# Altium schematic sheet REGENIX_ADC.SchDoc
size Tabloid; SheetNumber: 11; SheetTotal: 17; Sheet_Name: Insert name in Document Parameters; Size: 11x17
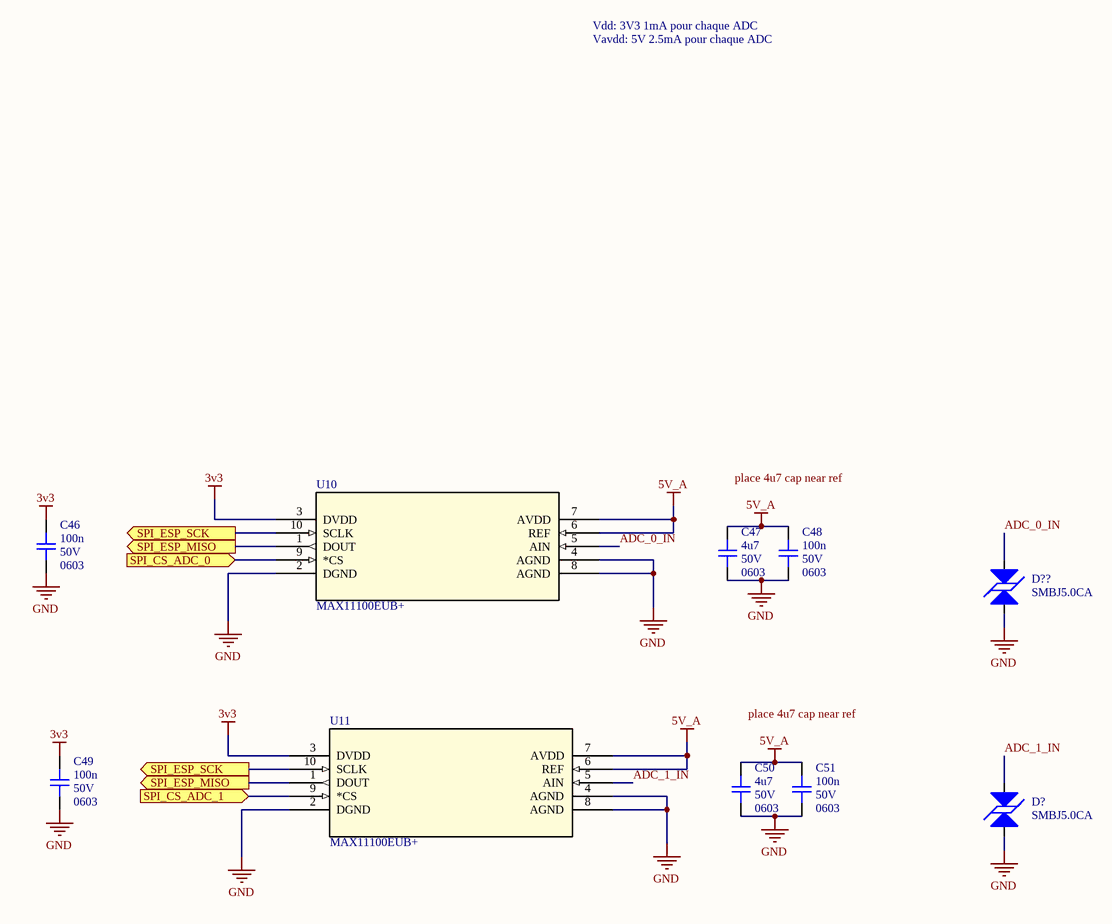
[diagram p0: REGENIX_ADC.SchDoc]

## Parts
C46  value 100n  Voltage: 50V  Package: 0603  [CAP_0603]  (hidden comment: CAP - 0603)
C47  value 4u7  Voltage: 50V  Package: 0603  [CAP_0603]  (hidden comment: CAP - 0603)
C48  value 100n  Voltage: 50V  Package: 0603  [CAP_0603]  (hidden comment: CAP - 0603)
C49  value 100n  Voltage: 50V  Package: 0603  [CAP_0603]  (hidden comment: CAP - 0603)
C50  value 4u7  Voltage: 50V  Package: 0603  [CAP_0603]  (hidden comment: CAP - 0603)
C51  value 100n  Voltage: 50V  Package: 0603  [CAP_0603]  (hidden comment: CAP - 0603)
D?  SMBJ5.0CA  [TVS_PWR_SMBJ5.0CA]
D??  SMBJ5.0CA  [TVS_PWR_SMBJ5.0CA]
U10  MAX11100EUB+  [21-0061L_MXM]
U11  MAX11100EUB+  [21-0061L_MXM]

## Ports
SPI_CS_ADC_0 (in), SPI_CS_ADC_1 (in), SPI_ESP_MISO (out), SPI_ESP_SCK (out)

## Nets
3v3: C46.2 C49.2 U10.3(DVDD) U11.3(DVDD)
5V_A: C47.2 C48.2 C50.2 C51.2 U10.6(REF) U10.7(AVDD) U11.6(REF) U11.7(AVDD)
GND: C46.1 C47.1 C48.1 C49.1 C50.1 C51.1 D?.2 D??.2 U10.2(DGND) U10.4(AGND) U10.8(AGND) U11.2(DGND) U11.4(AGND) U11.8(AGND)
ADC_0_IN: D??.1 U10.5(AIN)
ADC_1_IN: D?.1 U11.5(AIN)
SPI_CS_ADC_0: U10.9(*CS) ; port SPI_CS_ADC_0
SPI_CS_ADC_1: U11.9(*CS) ; port SPI_CS_ADC_1
SPI_ESP_MISO: U10.1(DOUT) U11.1(DOUT) ; port SPI_ESP_MISO
SPI_ESP_SCK: U10.10(SCLK) U11.10(SCLK) ; port SPI_ESP_SCK

## Notes on the sheet
- Vdd: 3V3 1mA pour chaque ADC
- Vavdd: 5V 2.5mA pour chaque ADC
- Labels drawn without touching a wire or pin: place 4u7 cap near ref
- Sheet Name
- Project Title
- Global Project
- Size
- Group
- Revision
- Date
- Sheet
- of
- Filename
- Designers

## Library data of the parts
C46-C51 = CAP - 0603: Precision: 10%; Current: *; CreatedBy: Jonathan Bouchard; Power: *
D? D?? = TVS_PWR_SMBJ5.0CA: TVS - BIDIR 5V 9.2V 600W - DO214AA; Manufacturer #1: Littelfuse Inc.; Value: Vbr = 6.4V -  Clamp = 9.2V; Voltage Rating: 5V Standoff; Current Rating: 65.3 A (Ipp); Power Max: 600W (Pppm); GRAMS Lib Spec: 2.8; Magnetic Material: UNKNOWN; Polarized: NO; Tolerance: *; HelpURL: http://www.littelfuse.com/~/media/electronics/datasheets/tvs_diodes/littelfuse_tvs_diode_smbj_datasheet.pdf.pdf; CreatedBy/Date: Jonathan Bouchard - 2019-03-22; VerifiedBy: Nicolas V. (2019-05-06); Temperature: -65°C ~ 150°C (TJ); Package: DO214AA; Manufacturer #2: *; Note: *; Assembly Type: SMD; Part Number #2: *; Part Number #1: SMBJ5.0CA; Supplier 1: Digi-Key; Supplier Part Number 1: SMBJ5.0CALFCT-ND; Cryo: UNKNOWN
U10 U11 = MAX11100EUB+: No Description Available; Mfr_Name: Analog Devices / Maxim Integrated; RefDes: RefDes; Type: Type